# EAGLE design VL6180_Sensor (EAGLE 6.5.0)
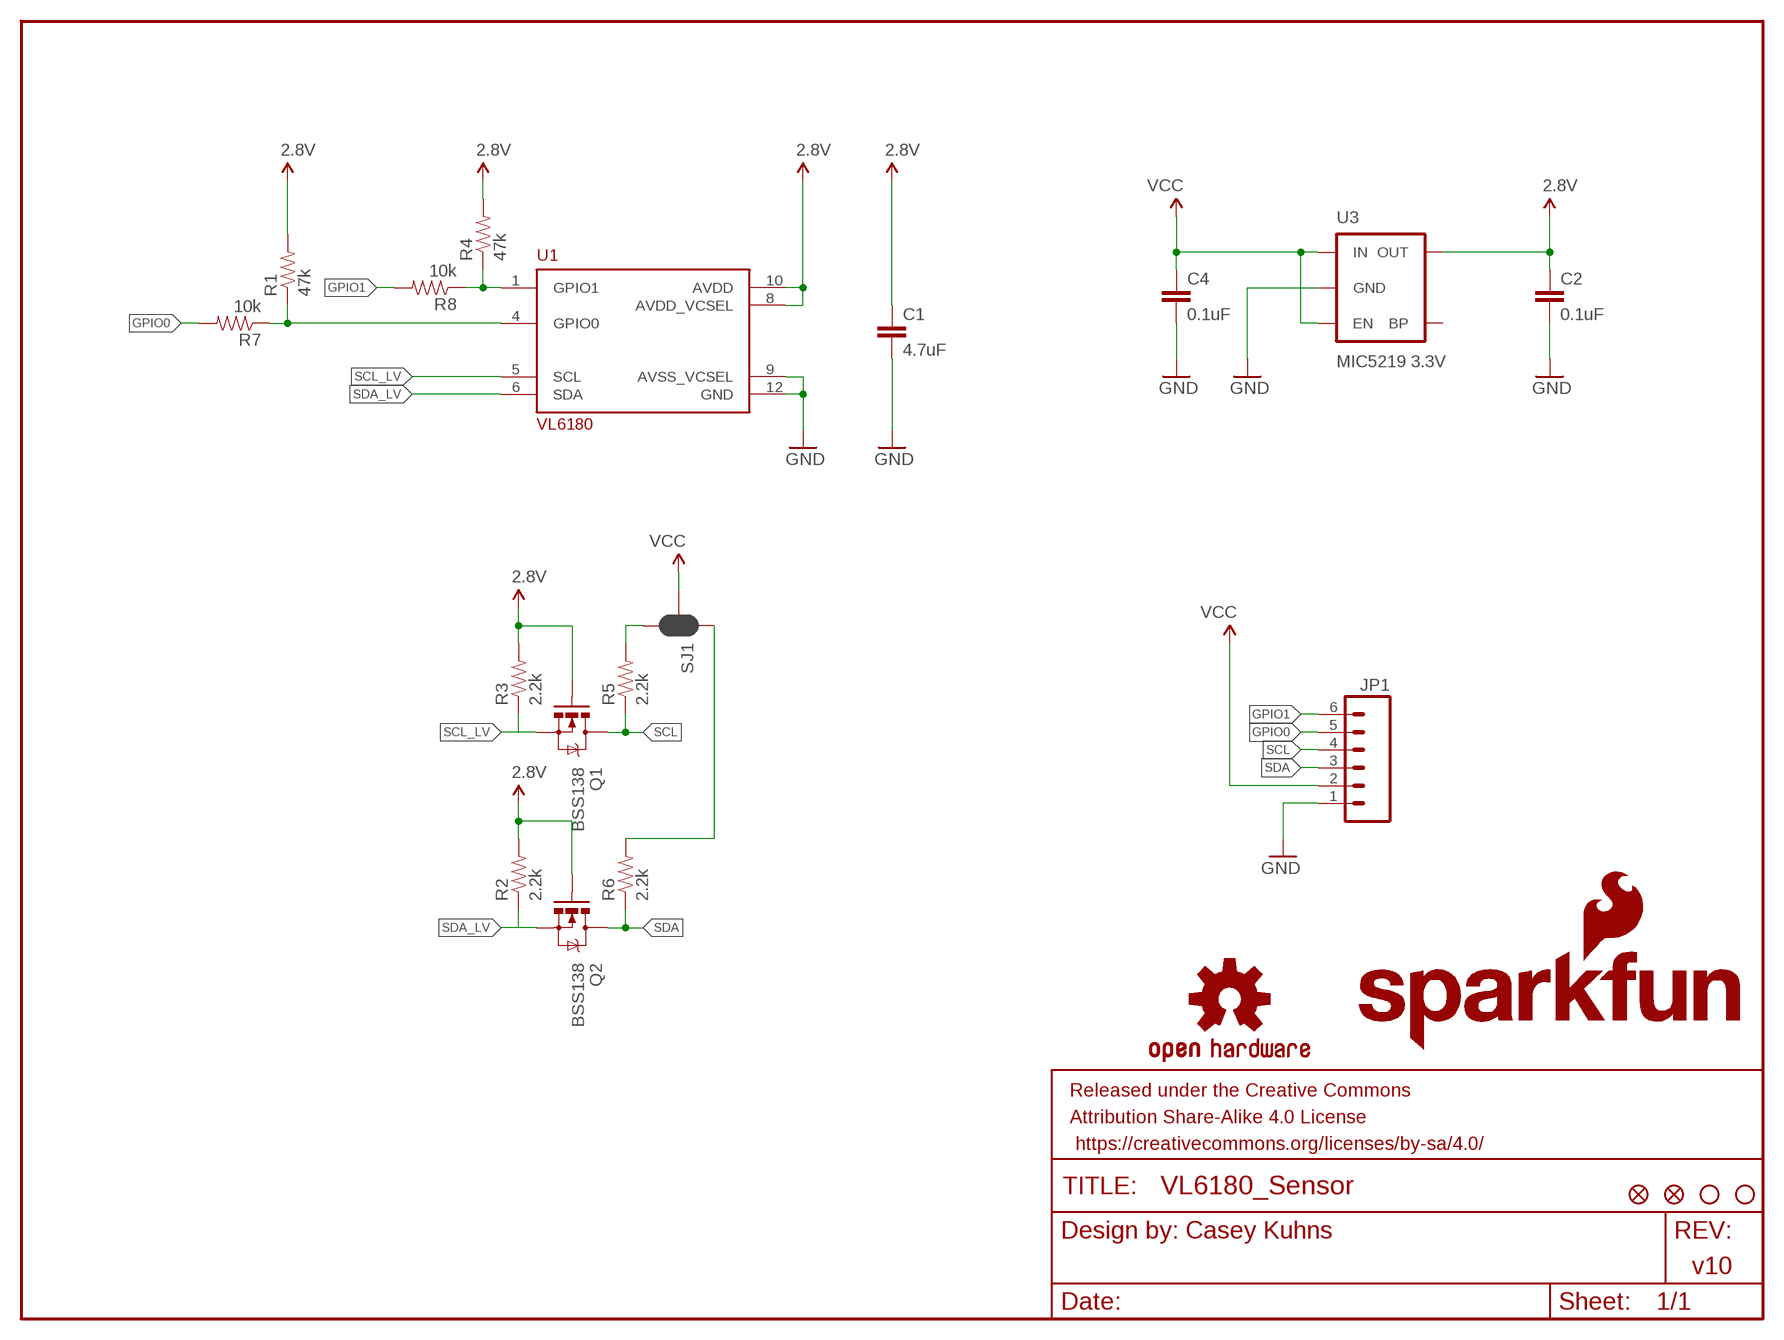
[diagram p0: schematic, sheet 1]

## Parts
C1  4.7uF  4.7UF-6.3V-10%(0603)0603  [0603-CAP]
C2  0.1uF  0.1UF-25V(+80/-20%)(0603)  [0603-CAP]
C4  0.1uF  0.1UF-25V(+80/-20%)(0603)  [0603-CAP]
FID1  FIDUCIAL1X2  [FIDUCIAL-1X2]
FID2  FIDUCIAL1X2  [FIDUCIAL-1X2]
FRAME1  FRAME-LETTER  [CREATIVE_COMMONS]
JP1  M06SIP  [1X06]
LOGO1  SFE_LOGO_NAME_FLAME.1_INCH  [SFE_LOGO_NAME_FLAME_.1]
LOGO2  OSHW-LOGOS  [OSHW-LOGO-S]
Q1  BSS138  MOSFET-NCHANNELBSS138  [SOT23]
Q2  BSS138  MOSFET-NCHANNELBSS138  [SOT23]
R1  47k  47KOHM1/10W1%(0603)  [0603-RES]
R2  2.2k  2.2KOHM1/10W1%(0603)  [0603-RES]
R3  2.2k  2.2KOHM1/10W1%(0603)  [0603-RES]
R4  47k  47KOHM1/10W1%(0603)  [0603-RES]
R5  2.2k  2.2KOHM1/10W1%(0603)  [0603-RES]
R6  2.2k  2.2KOHM1/10W1%(0603)  [0603-RES]
R7  10k  10KOHM1/10W1%(0603)0603  [0603-RES]
R8  10k  10KOHM1/10W1%(0603)0603  [0603-RES]
SJ1  JUMPER-PAD-3-NC_BY_PASTE  [PAD-JUMPER-3-NC_BY_PASTE_YES_SILK_FULL_BOX]
STANDOFF1  STAND-OFF  [STAND-OFF]
STANDOFF2  STAND-OFF  [STAND-OFF]
U1  VL6180  [VL6180]
U3  MIC5219 3.3V  V_REG_MIC52193.3V  [SOT23-5]

## Nets
2.8V: C1.1 C2.1 Q1.1(G) Q2.1(G) R1.2 R2.2 R3.2 R4.2 U1.8(AVDD_VCSEL) U1.10(AVDD) U3.5(OUT)
GND: C1.2 C2.2 C4.2 JP1.1 U1.9(AVSS_VCSEL) U1.12(GND) U3.2(GND)
GPIO0: JP1.5 R7.2
GPIO1: JP1.6 R8.2
N$2: R6.2 SJ1.1
N$3: R5.2 SJ1.3
N$100: R1.1 R7.1 U1.4(GPIO0)
N$103: R4.1 R8.1 U1.1(GPIO1)
SCL: JP1.4 Q1.3(D) R5.1
SCL_LV: Q1.2(S) R3.1 U1.5(SCL)
SDA: JP1.3 Q2.3(D) R6.1
SDA_LV: Q2.2(S) R2.1 U1.6(SDA)
VCC: C4.1 JP1.2 SJ1.2 U3.1(IN) U3.3(EN)
Unconnected: U3.4(BP)

## Notes on the sheet
- Casey Kuhns
- v10

## Library data of the parts
C1 = SparkFun-Capacitors:4.7UF-6.3V-10%(0603): CAP-08280; PROD_ID: CAP-08280
C2 C4 = SparkFun-Capacitors:0.1UF-25V(+80/-20%)(0603): CAP-00810 Ceramic Standard decoupling cap; PROD_ID: CAP-00810
FID1 FID2 = SparkFun-Aesthetics:FIDUCIAL: Fiducial Alignment Points Various fiducial points for machine vision alignment.
FRAME1 = SparkFun-Aesthetics:FRAME-LETTER: Schematic Frame Standard 8.5x11 US Letter frame
JP1 = SparkFun-Connectors:M06: Header 6 Standard 6-pin 0.1" header. Use with straight break away headers (SKU : PRT-00116), right angle break away headers (PRT-00553), swiss pins (PRT-00743), machine pins (PRT-00117), and female headers (PRT-00115). Molex polarized connector foot print use with SKU : PRT-08094 with associated crimp pins and housings. NOTES ON THE VARIANTS LOCK and LOCK_LONGPADS... This footprint was designed to help hold the alignment of a through-hole component (i.e. 6-pin header) while soldering it into place. You may notice that each hole has been shifted either up or down by 0.005 of an inch from it's more standard position (which is a perfectly straight line). This slight alteration caused the pins (the squares in the middle) to touch the edges of the holes. Because they are alternating, it causes a "brace" to hold the component in place. 0.005 has proven to be the perfect amount of "off-center" position when using our standard breakaway headers. Although looks a little odd when you look at the bare footprint, once you have a header in there, the alteration is very hard to notice. Also,if you push a header all the way into place, it is covered up entirely on the bottom side. This idea of altering the position of holes to aid alignment will be further integrated into the Sparkfun Library for other footprints. It can help hold any component with 3 or more connection pins.
LOGO1 = SparkFun-Aesthetics:SFE_LOGO_NAME_FLAME: SFE Logo, name and flame This is the SparkFun full logo. The logo on the schematic will always be the same size; the package variant is the height of the flame part of the logo. Default layer for the logo on the board is tSilk.
LOGO2 = SparkFun-Aesthetics:OSHW-LOGO: Open Source Hardware Logo This logo indicates the piece of hardware it is found on incorporates a OSHW license and/or adheres to the definition of open source hardware found here: http://freedomdefined.org/OSHW
Q1 Q2 = SparkFun-DiscreteSemi:MOSFET-NCHANNEL: Common NMOSFET Parts MFG P/N Store ID Prod ID FDD8780 TRANS-09984 SI7820DN TRANS-11055 FDS6630A IC-08089 2N7002PW TRANS-11151 FQP30N06L COM-10213 TRANS-10060 BSS123LT1G TRANS-08345 BSS138 TRANS-00830 BS170 2N7000; PROD_ID: TRANS-00830
R1 R4 = SparkFun-Resistors:47KOHM1/10W1%(0603): RES-07871; PROD_ID: RES-07871; VALUE: 47K
R2 R3 R5 R6 = SparkFun-Resistors:2.2KOHM1/10W1%(0603): RES-08272; PROD_ID: RES-08272
R7 R8 = SparkFun-Resistors:10KOHM1/10W1%(0603): RES-00824; PROD_ID: RES-00824; VALUE: 10K
SJ1 = SparkFun-Passives:JUMPER-PAD-3-NC_BY_PASTE
STANDOFF1 STANDOFF2 = SparkFun-Electromechanical:STAND-OFF: #4 Stand Off This is the mechanical footprint for a #4 phillips button head screw. Use the keepout ring to avoid running the screw head into surrounding components. SKU : PRT-00447
U1 = VL6180:VL6180; PROD_ID: IC-12007
U3 = SparkFun-PowerIC:V_REG_MIC5219: V_REG MIC5219 Standard 3.3V and 5V 500mA LDO voltage regulator in SOT-23 layout. Micrel part MIC5219. BP (by-pass) pin is used to lower output noise with 470pF cap, may be left open.; PROD_ID: VREG-09872

## Board
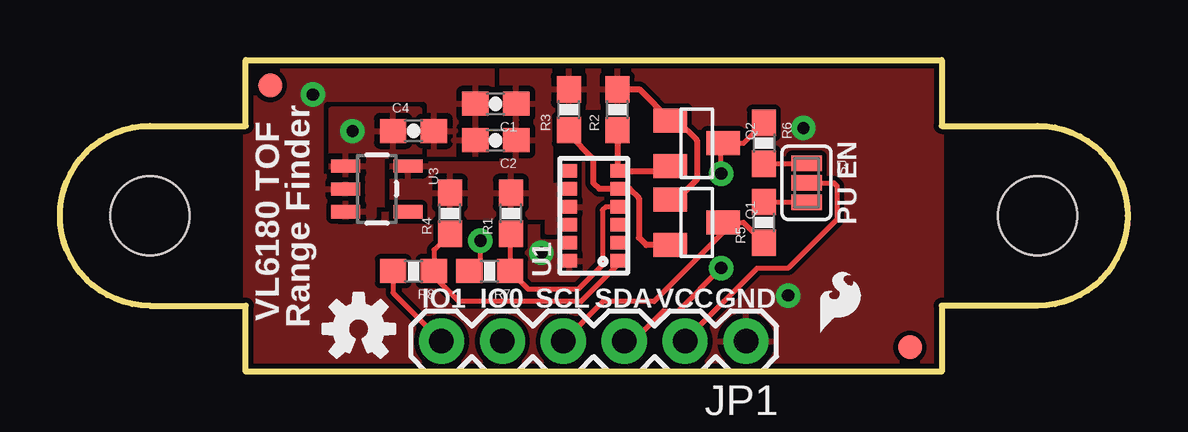
[diagram p1: board, top side]
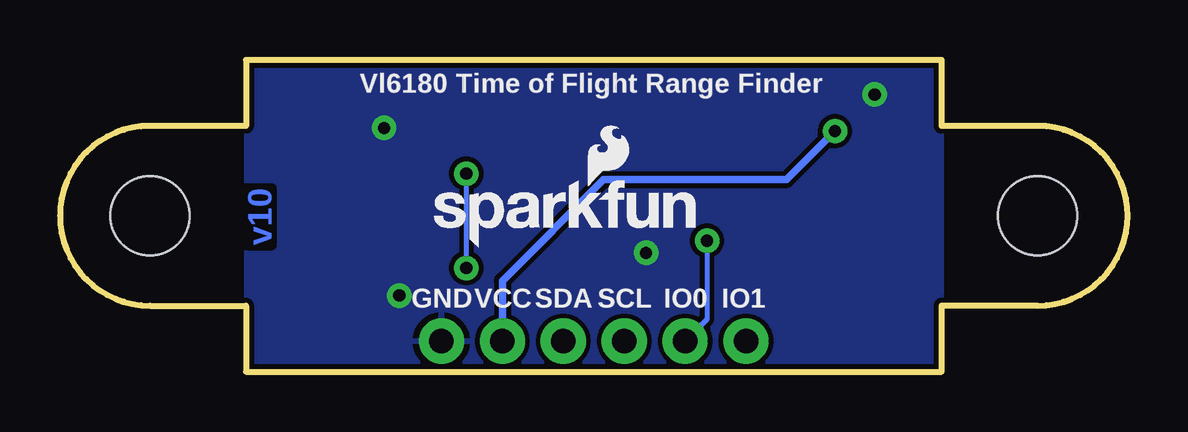
[diagram p2: board, bottom side, seen from below]

Size 44.5 x 13 mm. Coordinates in mm from the lower left corner, seen from the top.
Outline: 7.75,13 36.75,13 36.75,10.25 40.75,10.25 arc-180 40.75,2.75 36.75,2.75 36.75,0 7.75,0 7.75,2.75 3.75,2.75 arc-180 3.75,10.25 7.75,10.25 7.75,13
Copper layers (1*16): Top 0.035mm / dielectric 1.5mm / Bottom 0.035mm
Design rules "SparkFun-2-layer": minimum track width 7mil, minimum drill 15mil, track to track 8mil, track to pad 8mil, pad to pad 8mil, via to via 8mil, smd to smd 8mil, copper to edge 8mil, drill to drill 8mil, minimum pad ring 12mil, minimum via ring 10mil, stop-mask expansion 4mil, vias tented up to drill 20mil, thermal gap 10mil

### Footprints (pad centres in the part's own frame; a part is rotated, then mirrored left to right if it is on the bottom)
0603-CAP = smd 1.1 x 1: 1 -0.85,0; 2 0.85,0
FIDUCIAL-1X2 = smd 1 x 1: 1 0,0
1X06 = drill 1.016 pad 1.88: 1 0,0; 2 2.54,0; 3 5.08,0; 4 7.62,0; 5 10.16,0; 6 12.7,0
SOT23 = smd 1 x 1.4: 1 -0.95,-1.1; 2 0.95,-1.1; 3 0,1.1
0603-RES = smd 1.1 x 1: 1 -0.85,0; 2 0.85,0
PAD-JUMPER-3-NC_BY_PASTE_YES_SILK_FULL_BOX = smd 0.635 x 1.27: 1 -0.813,0; 2 0,0; 3 0.813,0
STAND-OFF = hole 3.302: 0,0
VL6180 = smd 0.55 x 0.6: 1 -1.875,-1; 2 -1.125,-1; 3 -0.375,-1; 4 0.375,-1; 5 1.125,-1; 6 1.875,-1; 7 1.875,1; 8 1.125,1; 9 0.375,1; 10 -0.375,1; 11 -1.125,1; 12 -1.875,1
SOT23-5 = smd 0.55 x 1.2: 1 -0.95,-1.3; 2 0,-1.3; 3 0.95,-1.3; 4 0.95,1.3; 5 -0.95,1.3

### Placement (x,y rotation side)
C1  18.16,11.18 180 top
C2  18.16,9.65 180 top
C4  14.73,10.03 0 top
FID1  8.77,11.94 0 top
FID2  35.44,1.02 0 top
FRAME1  7.75,-9.5 0 top  (outside the outline)
JP1  28.6,1.27 180 top
LOGO1  29.34,5.08 0 bottom
LOGO2  12.45,1.78 0 top
Q1  26.55,6.22 270 top
Q2  26.55,9.52 270 top
R1  18.8,6.6 90 top
R2  23.24,10.92 90 top
R3  21.21,10.92 90 top
R4  16.26,6.6 90 top
R5  29.34,6.22 90 top
R6  29.34,9.52 270 top
R7  17.91,4.19 180 top
R8  14.73,4.19 180 top
SJ1  31.12,7.87 270 top
STANDOFF1  3.75,6.5 0 top
STANDOFF2  40.75,6.5 0 top
U1  22.25,6.5 90 top
U3  13.21,7.62 270 top
U$2  [SFE_LOGO_FLAME_.1]  31.37,1.27 0 top

### Tracks (layer width: path | path; a pad name or v marks a point on that pad's centre or on a via)
2.8V
  Top 0.254: R2.2 24.15,11.77 Q2.1 25.72,10.47 26.55,9.65 26.55,8 25.72,7.17 Q1.1
  pour Top: 13.85,8.64 13.85,6.48 20.32,6.48 20.32,5.84 21.34,5.84 21.34,6.22 20.7,6.22 20.7,7.49 21.34,7.49 21.34,7.75 20.45,7.75 20.45,10.79 20.7,11.05 23.88,11.05 23.88,12.57 18.42,12.57 18.42,8.64
GND  (via drill 0.51)
  other vias: 30.36,3.17 10.54,11.56 30.99,10.16 20.07,4.95
  pour Top (rank 6): 7.75,13 36.75,13 36.75,0 7.75,0
  pour Bottom: 7.75,13 36.75,13 36.75,0 7.75,0
GPIO0  (via drill 0.51)
  Top 0.203: R7.2 17.53,4.66 v17.53,5.46
  Bottom 0.203: v17.53,5.46 17.53,2.18 JP1.5
GPIO1
  Top 0.203: R8.2 13.88,3.28 JP1.6
N$2
  Top 0.203: R6.2 31.11,8.67 SJ1.1
N$3
  Top 0.203: R5.2 31.11,7.07 SJ1.3
N$100
  Top 0.203: U1.4 22.75,6.87 22.61,6.73 22.61,4.44 21.59,3.43 19.52,3.43 R7.1 18.76,5.59 R1.1
N$103
  Top 0.203: U1.1 23.25,4.45 21.72,2.92 16.64,2.92 15.58,3.98 R8.1 15.58,5.08 R4.1
SCL
  Top 0.203: R5.1 28.49,6.22 Q1.3 27.65,5.8 24.77,2.92 22.63,2.92 JP1.4
SCL_LV
  Top 0.254: R3.1 21.21,9.91 22.23,8.89 22.23,7.87 22.48,7.62 22.49,7.62 U1.5 23.75,7.62 24.13,7.24 24.13,5.59 24.45,5.27 Q1.2
SDA  (via drill 0.51)
  Top 0.203: R6.1 28.49,9.52 Q2.3 27.56,9.44 v27.56,8.25 | v27.56,4.32 25.78,2.54 25.15,2.54 23.88,1.27 JP1.3
  Bottom 0.203: v27.56,4.32 v27.56,8.25
SDA_LV
  Top 0.254: R2.1 U1.6 25.45,8.37 Q2.2
VCC  (via drill 0.51)
  Top 0.203: SJ1.2 32.26,7.87 32.39,7.75 32.39,6.35 30.36,4.32 29.06,4.32 26.02,1.27 JP1.2
  Bottom 0.305: JP1.2 26.06,3.79 21.85,8 14.23,8 v12.19,10.03
  pour Top (rank 2): 11.31,8.13 12.7,8.13 12.7,6.98 11.56,6.98 11.56,6.48 13.08,6.48 13.08,6.98 14.99,6.98 14.99,10.92 11.31,10.92

### Text on the board
Bottom: v10
tPlace: PU EN | VL6180 TOF | Range Finder | IO1 | IO0 | SCL | SDA | VCC | GND
bPlace: Vl6180 Time of Flight Range Finder | IO1 | IO0 | SCL | SDA | VCC | GND
tDocu: Casey Kuhns